# Altium schematic sheet Power supply.SchDoc
size A4; SheetNumber: 2; SheetTotal: 3; SPICEModelCacheWOPLTYCT: <root> / <DocumentId>WOPLTYCT</DocumentId> / <CacheFrame Number="0"> / <Model Name="1n4001" Kind="MDL"> / <Text>*1N4001 MCE 8-16-95 / *50V 1A Si GenPurpose Diode pkg:DIODE0.4 1,2 / .MODEL 1N4001 D(IS=2.55E-9 RS=0.042 N=1.75 TT=5.76E-6 CJO=1.85E-11 / + VJ=0.75 M=0.333 BV=50 IBV=1E-5 )</Text> / </Model> / </CacheFrame> / </root>
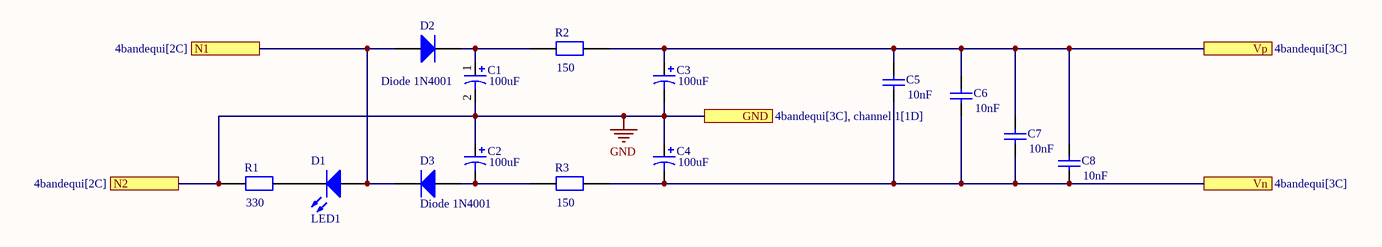
[diagram p0: Power supply.SchDoc]

## Parts
C1  value 100uF  [pol. cap.]  (hidden comment: Cap Pol1)
C2  value 100uF  [pol. cap.]  (hidden comment: Cap Pol1)
C3  value 100uF  [pol. cap.]  (hidden comment: Cap Pol1)
C4  value 100uF  [pol. cap.]  (hidden comment: Cap Pol1)
C5  value 10nF  [Capacitor]  (hidden comment: Cap)
C6  value 10nF  [Capacitor]  (hidden comment: Cap)
C7  value 10nF  [Capacitor]  (hidden comment: Cap)
C8  value 10nF  [Capacitor]  (hidden comment: Cap)
D1  LED1  [LED]
D2  Diode 1N4001  [DO-41]
D3  Diode 1N4001  [DO-41]
R1  value 330  [resistor]  (hidden comment: Resistor_Axial)
R2  value 150  [resistor]  (hidden comment: Resistor_Axial)
R3  value 150  [resistor]  (hidden comment: Resistor_Axial)

## Ports
GND (see 4bandequi[3C], channel 1[1D]), N1 (see 4bandequi[2C]), N2 (see 4bandequi[2C]), Vn (see 4bandequi[3C]), Vp (see 4bandequi[3C])

## Nets
GND: C1.2 C2.1 C3.2 C4.1 R1.1 ; port N2, port GND
N1: D1.1(A) D2.1(A) D3.2(K) ; port N1
Vn: C4.2 C5.2 C6.2 C7.2 C8.2 R3.2 ; port Vn
Vp: C3.1 C5.1 C6.1 C7.1 C8.1 R2.2 ; port Vp
NetC1_1: C1.1 D2.2(K) R2.1
NetC2_2: C2.2 D3.1(A) R3.1
NetD1_2: D1.2(K) R1.2

## Library data of the parts
C1-C4 = Cap Pol1: Polarized Capacitor (Radial); Published: 8-Jun-2000; LatestRevisionDate: 17-Jul-2002; LatestRevisionNote: Re-released for DXP Platform.; PackageReference: RB7.6-15; Publisher: Altium Limited; PackageDescription: Polarized Capacitor (Radial); 2 Leads
C5-C8 = Cap: Capacitor; Published: 8-Jun-2000; LatestRevisionDate: 17-Jul-2002; LatestRevisionNote: Re-released for DXP Platform.; PackageReference: RAD-0.3; Publisher: Altium Limited; PackageDescription: Radial Cap, Thru-Hole; 2 Leads; 0.3 in Pin Spacing
D1 = LED1: Typical RED GaAs LED; Published: 8-Jun-2000; LatestRevisionDate: 08-Jul-2005; LatestRevisionNote: Mech Layer 1 removed.; PackageReference: LED-1; Publisher: Altium Limited; PackageDescription: LED; 2 Leads
D2 D3 = Diode 1N4001: 1 Amp General Purpose Rectifier; Published: 8-Jun-2000; LatestRevisionDate: 17-Jul-2002; LatestRevisionNote: Re-released for DXP Platform.; DatasheetVersion: 1998; PackageVersion: Aug-1999; PackageReference: DO-41; Publisher: Altium Limited; PackageDescription: Diode, Axial; Body 5.2 x 2.7 mm (LxDia. max), Lead Dia. 0.86 mm (max); Code_JEDEC: DO-204-AL; ComponentLink1Description: Manufacturer Link; ComponentLink1URL: http://www.fairchildsemi.com/; ComponentLink2Description: Datasheet; ComponentLink2URL: http://www.fairchildsemi.com/ds/1N%2F1N4001.pdf
R1-R3 = Resistor_Axial: resistor; Resistance: *